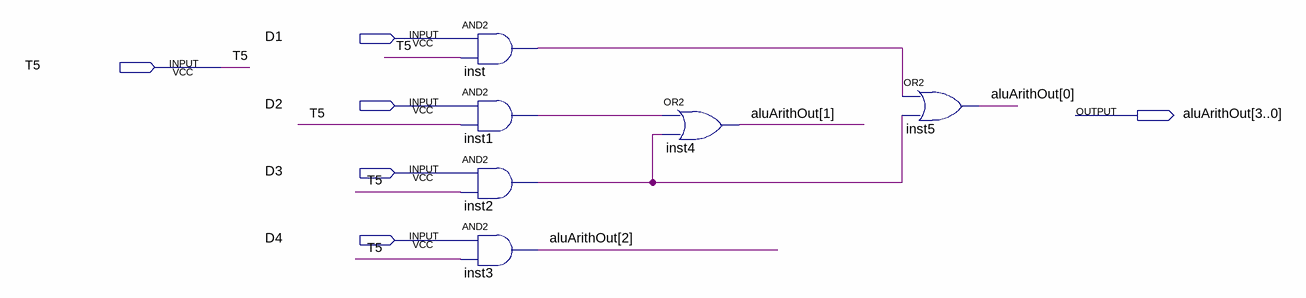
[diagram p0: schematic sheet]
// Quartus schematic ALUArith.bdf as structural Verilog: 6 symbols, 6 pins
module ALUArith (
  input  D1,
  input  T5,
  input  D2,
  input  D3,
  input  D4,
  output [3:0] aluArithOut
);

  wire inst1_out, inst2_out, inst_out;

  and inst (inst_out, D1, T5);
  and inst1 (inst1_out, D2, T5);
  and inst2 (inst2_out, D3, T5);
  and inst3 (aluArithOut[2], D4, T5);
  or inst4 (aluArithOut[1], inst1_out, inst2_out);
  or inst5 (aluArithOut[0], inst_out, inst2_out);
endmodule
